# Altium schematic sheet CAMERA.SchDoc: CAMERA
size A4; Date: Not used; ApprovedBy: Not used; CheckedBy: Not used; Author: Not used; CompanyName: STMicroelectronics; DrawnBy: Not used; Engineer: Not used; Organization: Not used; Address1: Not used; Address2: Not used; Address3: Not used; Address4: Not used; DocumentNumber: Not used; Revision: Not used; SheetNumber: 11; SheetTotal: 18; CurrentTime: Not used; CurrentDate: Not used; Time: Not used; DocumentFullPathAndName: Not used; DocumentName: Not used; ModifiedDate: Not used; ImagePath: Not used; ProjectName: Not used; Application_BuildNumber: Not used
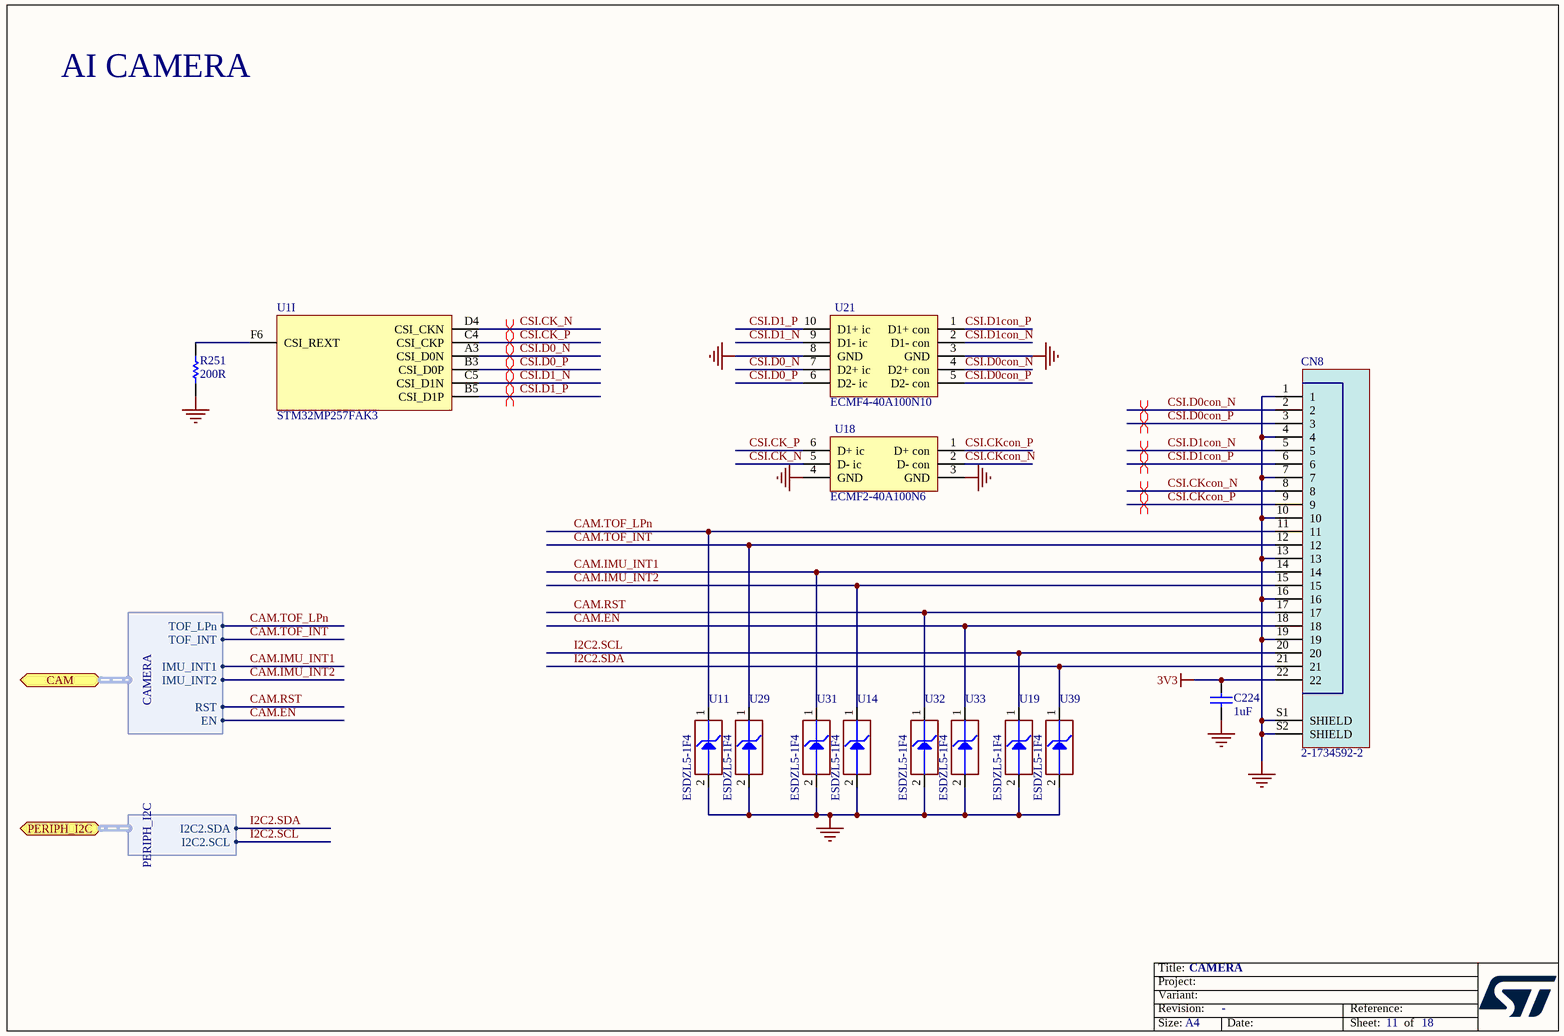
[diagram p0: CAMERA.SchDoc]

## Parts
C224  value 1uF  [C0402]  (hidden comment: Capacitor)
CN8  2-1734592-2  [CON_TE-CONNECTIVITY_2-1734592-2_INV]
R251  value 200R  [R0402]  (hidden comment: Resistor)
U1  STM32MP257FAK3  [ICC_TFBGA424_14X14_P050_H1P20_CODE-B0A2]  (part I of 9)
U11  value ESDZL5-1F4  [ESD_ST0201]  (hidden comment: ESD-TRANSIL)
U14  value ESDZL5-1F4  [ESD_ST0201]  (hidden comment: ESD-TRANSIL)
U18  ECMF2-40A100N6  [ESD_UQFN-6L_1P45X1P4_P040]
U19  value ESDZL5-1F4  [ESD_ST0201]  (hidden comment: ESD-TRANSIL)
U21  ECMF4-40A100N10  [ESD_UQFN-10L_2P25X1P4_P040]
U29  value ESDZL5-1F4  [ESD_ST0201]  (hidden comment: ESD-TRANSIL)
U31  value ESDZL5-1F4  [ESD_ST0201]  (hidden comment: ESD-TRANSIL)
U32  value ESDZL5-1F4  [ESD_ST0201]  (hidden comment: ESD-TRANSIL)
U33  value ESDZL5-1F4  [ESD_ST0201]  (hidden comment: ESD-TRANSIL)
U39  value ESDZL5-1F4  [ESD_ST0201]  (hidden comment: ESD-TRANSIL)

## Ports
CAM (bidir, harness CAMERA), PERIPH_I2C (bidir, harness PERIPH_I2C)

## Harnesses
PERIPH_I2C: I2C2.SDA, I2C2.SCL
CAMERA: TOF_LPn, TOF_INT, IMU_INT1, IMU_INT2, RST, EN

## Nets
3V3: C224.2 CN8.22
GND: C224.1 CN8.1 CN8.4 CN8.7 CN8.10 CN8.13 CN8.16 CN8.19 CN8.S1(SHIELD) CN8.S2(SHIELD) R251.2 U11.2(GND) U14.2(GND) U18.3(GND) U18.4(GND) U19.2(GND) U21.3(GND) U21.8(GND) U29.2(GND) U31.2(GND) U32.2(GND) U33.2(GND) U39.2(GND)
CAM.EN: CN8.18 U33.1(IO1) ; port CAM.EN
CAM.IMU_INT1: CN8.14 U31.1(IO1) ; port CAM.IMU_INT1
CAM.IMU_INT2: CN8.15 U14.1(IO1) ; port CAM.IMU_INT2
CAM.RST: CN8.17 U32.1(IO1) ; port CAM.RST
CAM.TOF_INT: CN8.12 U29.1(IO1) ; port CAM.TOF_INT
CAM.TOF_LPn: CN8.11 U11.1(IO1) ; port CAM.TOF_LPn
CSI.CK_N: U1.D4(CSI_CKN) U18.5(D-_ic)
CSI.CK_P: U1.C4(CSI_CKP) U18.6(D+_ic)
CSI.CKcon_N: CN8.8 U18.2(D-_con)
CSI.CKcon_P: CN8.9 U18.1(D+_con)
CSI.D0_N: U1.A3(CSI_D0N) U21.7(D2+_ic)
CSI.D0_P: U1.B3(CSI_D0P) U21.6(D2-_ic)
CSI.D0con_N: CN8.2 U21.4(D2+_con)
CSI.D0con_P: CN8.3 U21.5(D2-_con)
CSI.D1_N: U1.C5(CSI_D1N) U21.9(D1-_ic)
CSI.D1_P: U1.B5(CSI_D1P) U21.10(D1+_ic)
CSI.D1con_N: CN8.5 U21.2(D1-_con)
CSI.D1con_P: CN8.6 U21.1(D1+_con)
I2C2.SCL: CN8.20 U19.1(IO1) ; port PERIPH_I2C.I2C2.SCL
I2C2.SDA: CN8.21 U39.1(IO1) ; port PERIPH_I2C.I2C2.SDA
NetR251_1: R251.1 U1.F6(CSI_REXT)

## Layout directives
differential pair: CSI.CK_N, CSI.CK_P, CSI.CKcon_N, CSI.CKcon_P, CSI.D0_N, CSI.D0_P, CSI.D0con_N, CSI.D0con_P, CSI.D1_N, CSI.D1_P, CSI.D1con_N, CSI.D1con_P

## Notes on the sheet
- AI CAMERA
- Title:
- Project:
- Size:
- Revision:
- Variant:
- A4
- -
- Date:
- Reference:
- Sheet:
- of

## Library data of the parts
C224 = MCD-00095: Capacitor, MLCC, 1uF, 25V, X5R, +/-10%, 0402, T=0,5mm; Manufacturer_Part_Number: GRM155R61E105KA12; Manufacturer: MURATA; Part_Preference: Recommended; Alternate_Manufacturer_Part_Number: GRM155R60J105KE19; Order_Code_RS: 846-7287; Component_Country_Of_Origin: Japan; ID: 2772; ShowFields: YES; Internal_Part_Number: MCD-00095; Status: Released; Part_Type: Capacitor; Package: 0402; ComponentLink1Description: Datasheet; ComponentLink1URL: http://tunmcdsvn.tun.st.com/Component_Documentation_Library/Trunk/Capacitor/MURATA_GRM_Series; Order_Code_Digikey: 490-10017-1-ND; Order_Code_Farnell: 2218855; Alternate_Manufacturer: MURATA
CN8 = MCD-03600: Socket_FFC/FPC, 22pins, 0.5mm, RA, SMD, T=2mm; Part_Type: Connector; Part_Preference: Recommended; Manufacturer: TE CONNECTIVITY; Component_Country_Of_Origin: China°; ShowFields: YES; ID: 5716; ComponentLink1URL: http://tunmcdsvn.tun.st.com/Component_Documentation_Library/Trunk/Connector/TE_CONNECTIVITY_2-1734592-2; Internal_Part_Number: MCD-03600; Value: 2-1734592-2; Status: New; Manufacturer_Part_Number: 2-1734592-2; Order_Code_Digikey: A101307TR-ND; Order_Code_Farnell: 3398660; Order_Code_RS: N/A
R251 = MCD-00417: Resistor, 200R, 0402, +/-1%, 1/16W; Manufacturer_Part_Number: RC0402FR-07200RL; Manufacturer: YAGEO; Part_Preference: Recommended; Component_Country_Of_Origin: China; ID: 2860; ShowFields: YES; Internal_Part_Number: MCD-00417; Status: Released; Part_Type: Resistor; Package: 0402; ComponentLink1URL: http://tunmcdsvn.tun.st.com/Component_Documentation_Library/Trunk/Resistor/YAGEO_RC_L_Series; Order_Code_Digikey: 311-200LRCT-ND; Order_Code_Farnell: 1458756; Order_Code_RS: N/A
U1 = MCD-03375: MPU , 2xCortex-A35@1.5GHz, Cortex-M33@400MHz, TFBGA 14x14, pitch 0.5, 648KB SRAM, With Crypto; Part_Type: IC; Part_Preference: Recommended; Manufacturer: STMICROELECTRONICS; Component_Country_Of_Origin: Unknown; ShowFields: YES; ID: 5491; Value: STM32MP257FAK3; Internal_Part_Number: MCD-03375; Status: Checked; Manufacturer_Part_Number: STM32MP257FAK3; Package: TFBGA; ComponentLink1URL: http://tunmcdsvn.tun.st.com/Component_Documentation_Library/Trunk/IC/STMICROELECTRONICS_STM32MP257FAK3; Order_Code_Digikey: N/A; Order_Code_Farnell: N/A; Order_Code_RS: N/A
U11 U14 U19 U29 U31-U33 U39 = MCD-03501: ESD protection , 0201; Part_Type: IC; Part_Preference: Recommended; Manufacturer: STMICROELECTRONICS; ShowFields: YES; ID: 5617; Order_Code_RS: 163-7318; Internal_Part_Number: MCD-03501; Status: New; Manufacturer_Part_Number: ESDZL5-1F4; ComponentLink1URL: http://tunmcdsvn.tun.st.com/Component_Documentation_Library/Trunk/IC/STMICROELECTRONICS_ESDZL5-1F4; Order_Code_Digikey: 497-17544-2-ND; Order_Code_Farnell: ESDZL5-1F4; Package: 0201; Full_Alternate_Internal_Part_Number: N/A
U18 = MCD-03060: ESD protection & Common Filter High Speed serial Interfaces , 0.4 pitch; Part_Type: IC; Part_Preference: Recommended; Manufacturer: STMICROELECTRONICS; ShowFields: YES; ID: 5176; Component_Country_Of_Origin: China; ComponentLink1Description: Datasheet; ComponentLink1URL: http://tunmcdsvn.tun.st.com/Component_Documentation_Library/Trunk/IC/STMICROELECTRONICS_ECMF4-40A100N10; Internal_Part_Number: MCD-03060; Value: ECMF2-40A100N6; Status: Checked; Manufacturer_Part_Number: ECMF2-40A100N6; Package: uQFN-6; Order_Code_Digikey: 497-ECMF2-40A100N6; Order_Code_Farnell: 3993603; Order_Code_RS: N/A
U21 = MCD-03059: ESD protection & Common Filter High Speed serial Interfaces , 0.4 pitch; Part_Type: IC; Part_Preference: Recommended; Manufacturer: STMICROELECTRONICS; ShowFields: YES; ID: 5175; Component_Country_Of_Origin: China; ComponentLink1Description: Datasheet; ComponentLink1URL: http://tunmcdsvn.tun.st.com/Component_Documentation_Library/Trunk/IC/STMICROELECTRONICS_ECMF4-40A100N10; Internal_Part_Number: MCD-03059; Value: ECMF4-40A100N10; Status: Checked; Manufacturer_Part_Number: ECMF4-40A100N10; Package: uQFN-10L; Order_Code_Digikey: 497-ECMF4-40A100N10; Order_Code_Farnell: N/A; Order_Code_RS: N/A